# EasyEDA Pro project JP_Board.eprj, board PCB1
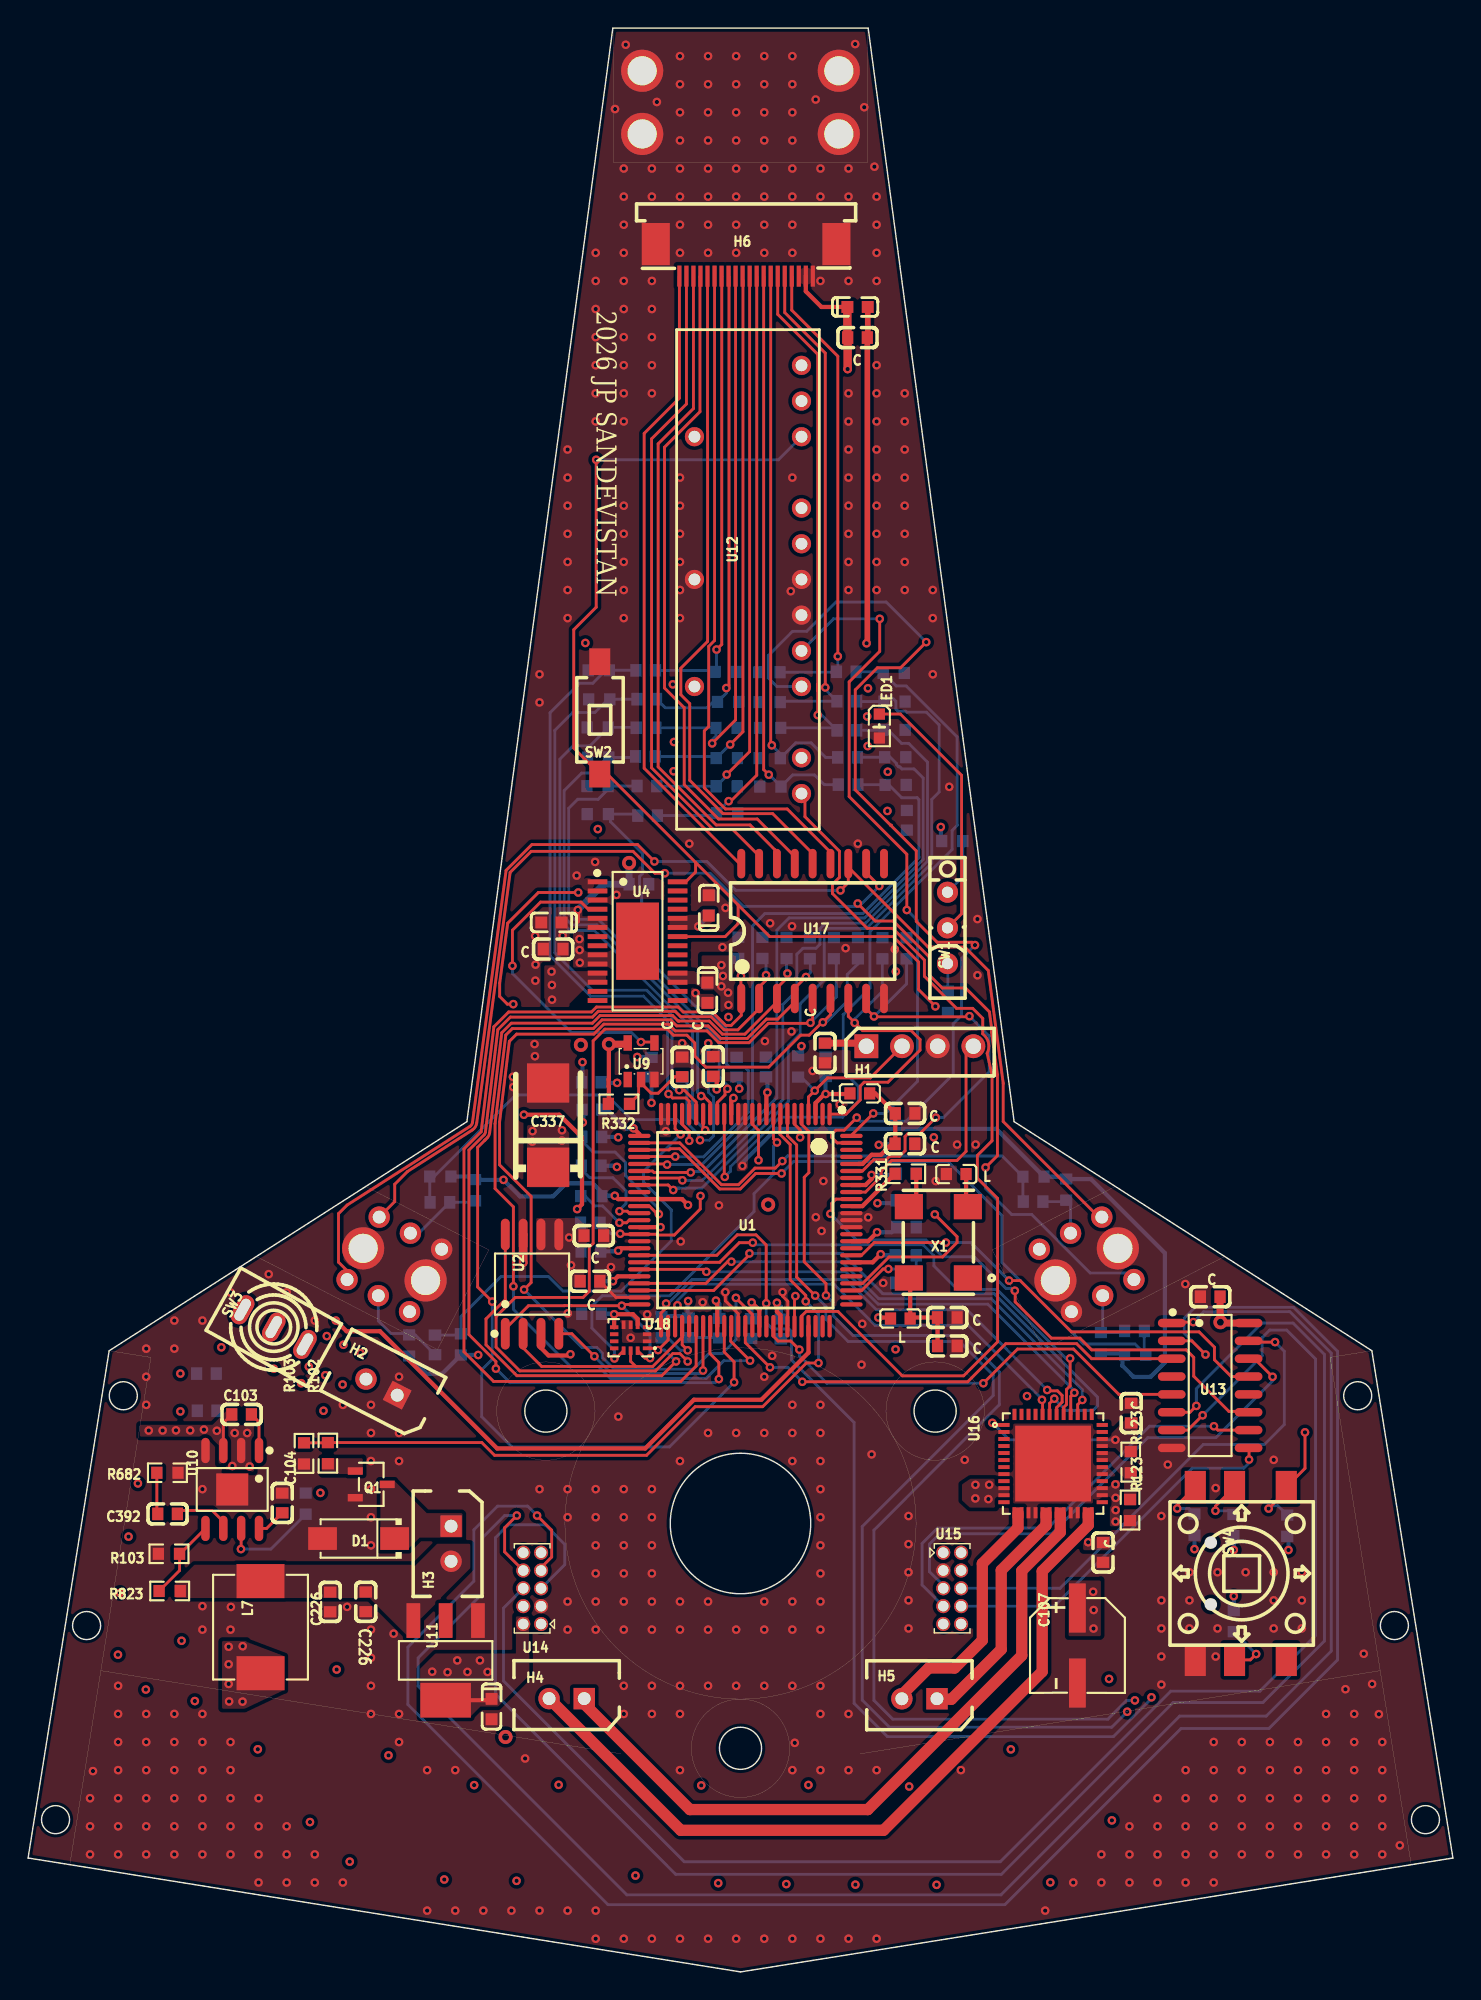
[diagram p3: board, top side]
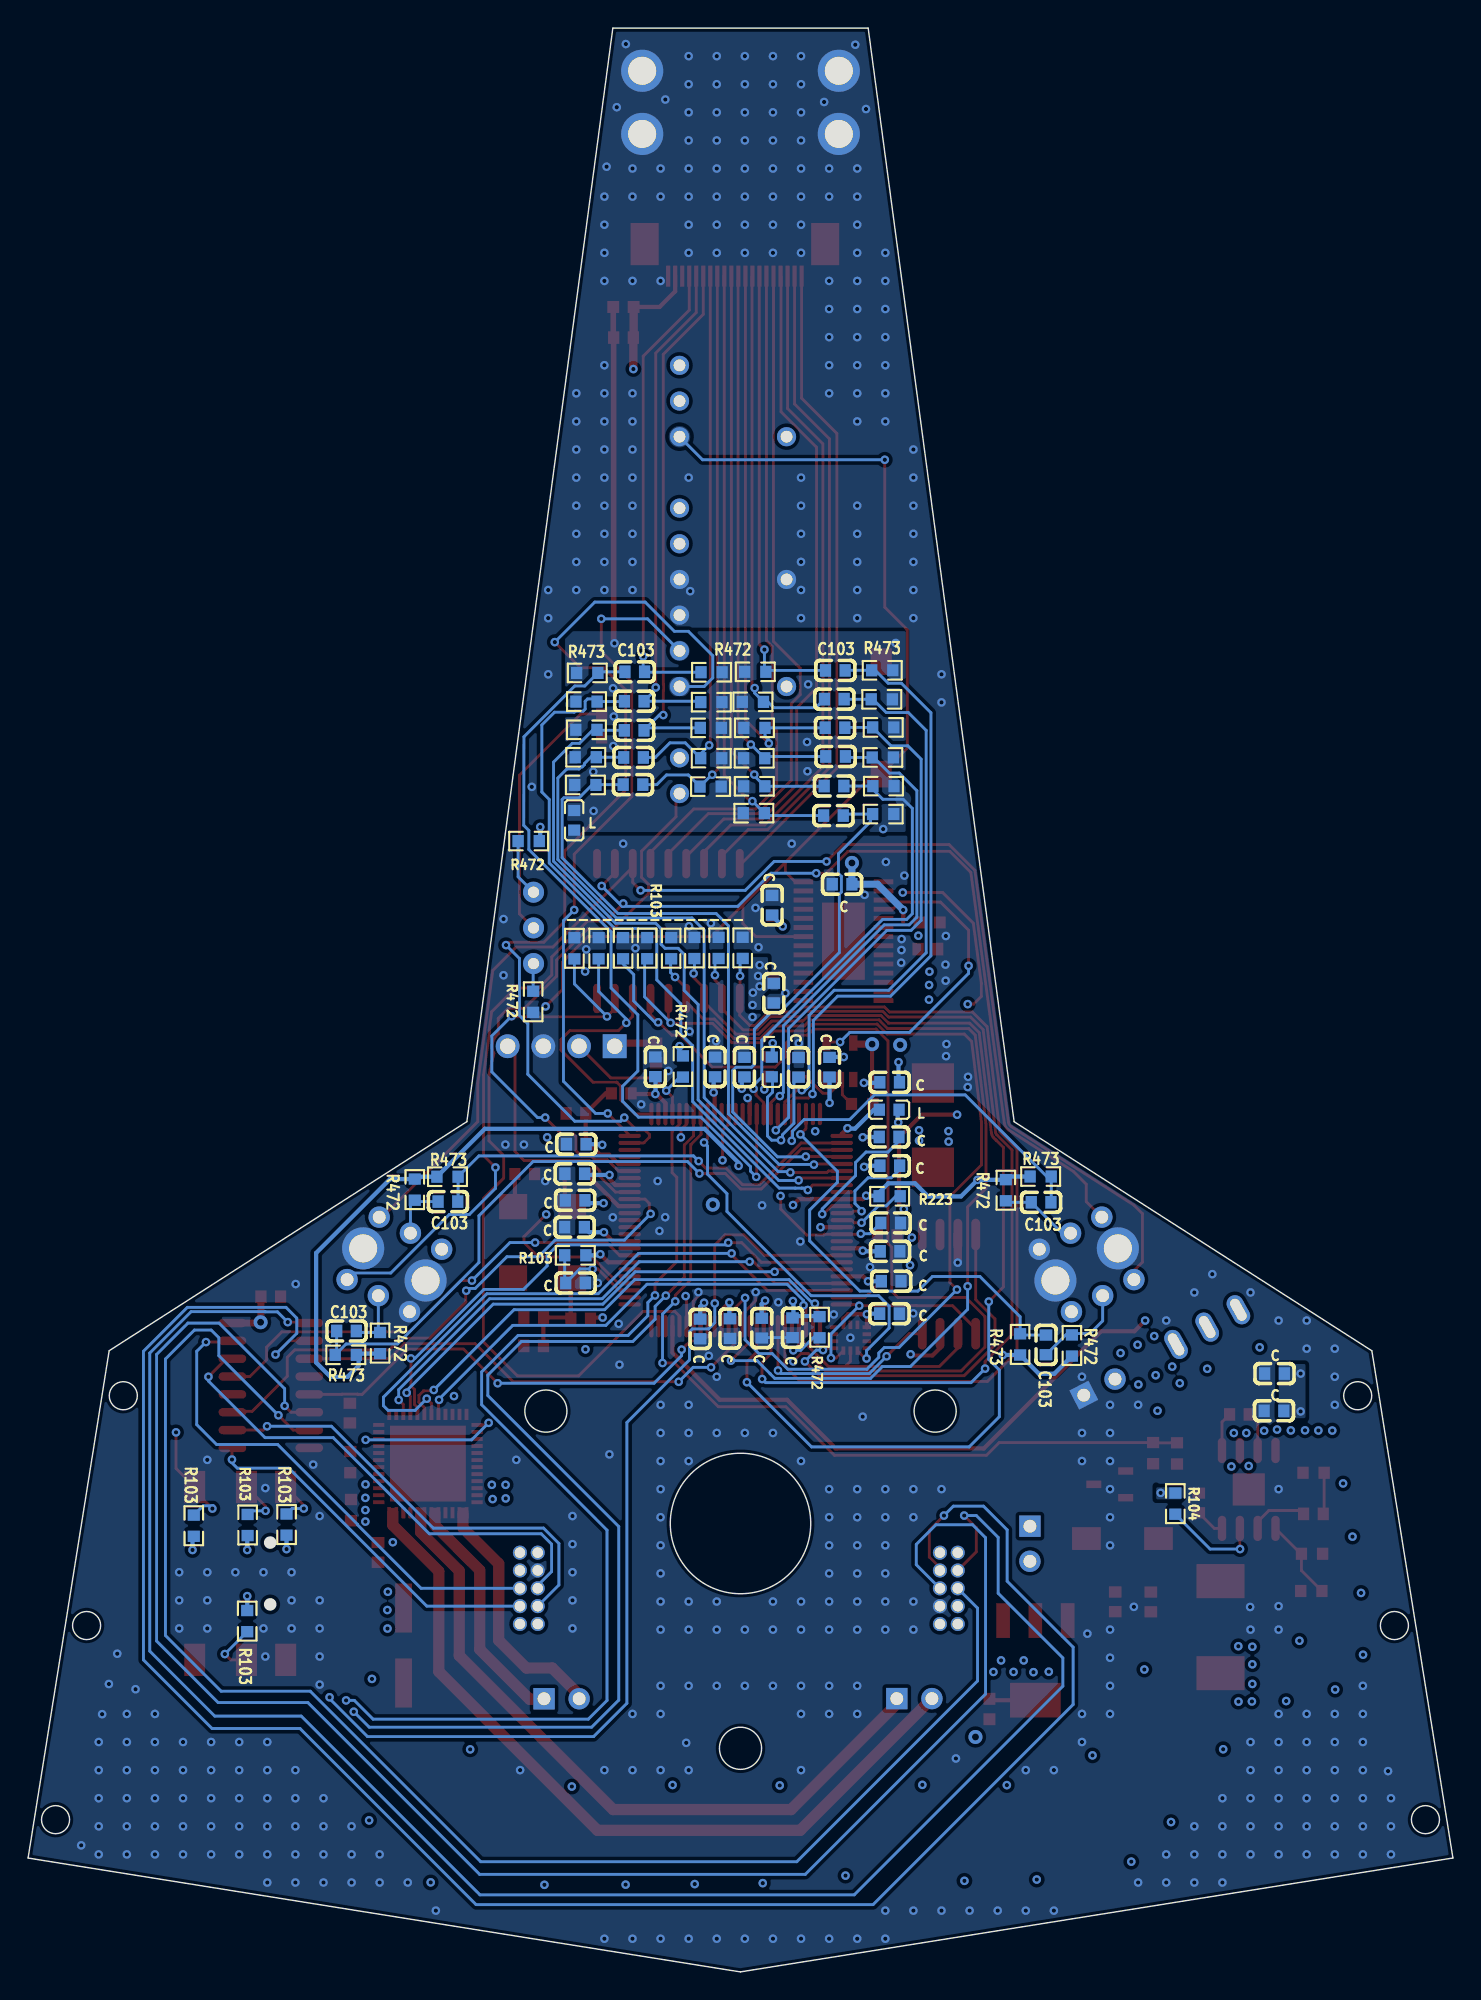
[diagram p4: board, bottom side, seen from below]

Outline 101.44 x 138.36 mm; copper layers: Top Layer, Inner1, Inner2, Bottom Layer. Coordinates in mm from the lower left corner of the outline.
Outline path: circle c1.95,10.84 r1 ; circle c4.16,24.65 r1 ; circle c6.78,41.01 r1 ; circle c36.86,39.92 r1.5 ; circle c50.72,31.92 r5 ; circle c50.72,15.92 r1.5 ; circle c64.58,39.92 r1.5 ; circle c94.66,41.01 r1 ; circle c97.28,24.65 r1 ; circle c99.48,10.84 r1 ; 0,8.11 5.77,44.21 31.24,60.52 41.63,138.36 59.81,138.36 70.2,60.52 95.67,44.21 101.44,8.11 50.72,0 0,8.11
Stack: Top Layer 0.035mm Outer layer thickness 1oz / Dielectric1 0.2104mm 7628 RC49% 8.6mil / Inner1 0.0152mm Inner layer thickness / Dielectric2 1.065mm 1.1mm H/HOZ Copper / Inner2 0.0152mm Inner layer thickness / Dielectric3 0.2104mm 7628 RC49% 8.6mil / Bottom Layer 0.035mm Outer layer thickness 1oz

## Design rules (mm)
template: Custom Config
spacing copperThickness1oz (default): track to track 0.102, other pairs 0.152 to 0.3
spacing copperThickness2oz: track to track 0.203, other pairs 0.152 to 0.3
spacing 5V: track to track 0.3, other pairs 0.152 to 0.3
track width copperThickness1oz (default): min 0.127, default 0.203, max 2.54
track width copperThickness2oz: min 0.203, default 0.254, max 2.54
track width 5V: min 0.127, default 0.3, max 2.54
track width 3.3V: min 0.127, default 0.3, max 2.54
differential pair differentialPair (default): width min 0.127, default 0.254, max 2.54; gap min 0.152, default 0.152
via viaSize (default): diameter min 0.5, default 0.61, max 10; hole min 0.3, default 0.305, max 6.3
net 5V uses 5V
net AGND uses 3.3V
net ADC_ANALOG_PWR uses 3.3V
net 3.3V uses 3.3V
net 1.8V uses 3.3V

## Placement (name value [footprint] x y rotation side)
C  -  [C0603]  40 49.16 0 top
C47  100nF  [C0603]  43.97 92.64 180 bottom
C48  100nF  [C0603]  44.04 90.59 180 bottom
C49  100nF  [C0603]  43.99 88.56 180 bottom
C50  100nF  [C0603]  43.95 86.51 180 bottom
C51  100nF  [C0603]  44.06 84.41 180 bottom
C52  100nF  [C0603]  44.1 82.31 180 bottom
C53  100nF  [C0603]  58.38 84.51 0 bottom
C54  100nF  [C0603]  58.34 86.45 0 bottom
C55  100nF  [C0603]  58.29 88.38 0 bottom
C56  100nF  [C0603]  58.28 90.45 0 bottom
C57  100nF  [C0603]  58.25 92.54 0 bottom
C58  100nF  [C0603]  28.97 44.63 90 bottom
C59  100nF  [C0603]  29.32 54.78 180 bottom
C60  100nF  [C0603]  71.55 54.83 180 bottom
C61  100nF  [C0603]  78.77 45.62 0 bottom
C103  100nF  [C0603]  15.2 39.68 0 top
C104  100nF  [C0603]  18.09 33.38 90 top
C107  100uF  [CAP-SMD_BD6.3-L6.6-W6.6-FD]  74.71 23.23 270 top
C226  -  [C0603]  24.04 26.34 270 top
C226#2  -  [C0603]  21.51 26.34 270 top
C337  330uF  [CASE-D_7343]  37.02 60.27 270 top
C392  100nF  [C0603]  9.93 32.6 0 top
C476  -  [CAP-SMD_L1.6-W0.8]  59.06 118.51 180 top
C476#2  -  [CAP-SMD_L1.6-W0.8]  48.46 75.91 270 top
C#2  -  [C0603]  76.53 29.86 90 top
C#3  -  [C0603]  78.53 39.77 90 top
C#4  -  [C0603]  65.44 46.58 0 top
C#5  -  [C0603]  48.78 64.45 90 top
C#6  -  [C0603]  65.45 44.56 0 top
C#7  -  [C0603]  56.74 65.41 90 top
C#8  -  [C0603]  62.43 58.95 0 top
C#9  -  [C0603]  62.44 61.11 0 top
C#10  -  [C0603]  59.05 116.33 0 top
C#11  -  [C0603]  84.16 48.06 180 top
C#12  -  [C0603]  46.56 64.42 270 top
C#13  -  [C0603]  40.27 52.41 0 top
C#14  -  [C0603]  37.38 72.81 180 top
C#15  -  [C0603]  40.09 57.38 180 bottom
C#16  -  [C0603]  40.14 59.43 0 bottom
C#17  -  [C0603]  62.41 58.91 0 bottom
C#18  -  [C0603]  51.47 45.79 270 bottom
C#19  -  [C0603]  53.59 45.77 270 bottom
C#20  -  [C0603]  62.53 53.01 0 bottom
C#21  -  [C0603]  40.07 51.29 180 bottom
C#22  -  [C0603]  12.74 39.94 0 bottom
C#23  -  [C0603]  12.7 42.59 0 bottom
C#24  -  [C0603]  40.11 46.85 0 bottom
C#25  -  [C0603]  52.53 64.41 90 bottom
C#26  -  [C0603]  62.52 56.81 0 bottom
C#27  -  [C0603]  49.2 45.82 270 bottom
C#28  -  [C0603]  62.49 54.92 180 bottom
C#29  -  [C0603]  50.44 64.4 270 bottom
C#30  -  [C0603]  40.03 53.31 180 bottom
C#31  -  [C0603]  46.59 64.39 90 bottom
C#32  -  [C0603]  56.78 64.42 90 bottom
C#33  -  [C0603]  44.38 64.39 90 bottom
C#34  -  [C0603]  40.1 63.32 180 bottom
C#35  -  [C0603]  43.49 77.42 0 bottom
C#36  -  [C0603]  48.47 75.92 90 bottom
C#37  -  [C0603]  48.35 69.67 270 bottom
C#38  -  [C0603]  62.46 49.04 180 bottom
C#39  -  [C0603]  47.02 45.85 270 bottom
C#40  -  [C0603]  39.99 49.16 180 bottom
D1  1N4007  [SMA_L4.4-W2.8-LS5.4-RD]  23.53 30.85 180 top
H1  -  [HDR-TH_4P-P2.54-V-F]  63.49 65.89 0 top
H2  Molex_5267_2P  [5267_2P]  26.28 41.05 152.8 top
H3  Molex_5267_2P  [5267_2P]  30.12 31.73 270 top
H4  RMOTOR  [5267_2P]  39.59 19.45 180 top
H5  LMOTOR  [5267_2P]  64.71 19.44 180 top
H6  AFC07-S20ECA-00  [FPC-SMD_AFC07-S20ECA-00]  51.12 121.84 180 top
L  -  [L0603]  62.1 46.51 0 top
L7  10uH  [IND-SMD_L7.3-W6.6]  16.55 24.54 270 top
L#2  -  [L0603]  66.08 56.79 0 top
L#3  -  [L0603]  59.22 62.53 0 top
L#4  -  [L0603]  48.49 64.41 270 bottom
L#5  -  [L0603]  40.13 61.37 180 bottom
L#6  -  [L0603]  62.56 81.97 90 bottom
LED1  -  [LED0603-R-RD]  60.6 88.68 270 top
NOREF  -  [Pad_e358]  73.14 49.22 0 top
NOREF#2  -  [Pad_e355]  72 51.44 180 top
NOREF#3  -  [Pad_e339]  29.44 51.44 0 top
NOREF#4  -  [Pad_e347]  25 53.72 0 top
NOREF#5  -  [Pad_e2882]  57.72 130.83 0 top
NOREF#6  -  [Pad_e2880]  43.72 135.32 0 top
NOREF#7  -  [Pad_e360]  77.59 51.5 0 top
NOREF#8  -  [Pad_e325]  28.3 49.22 0 top
NOREF#9  -  [Pad_e2881]  57.72 135.32 0 top
NOREF#10  -  [Pad_e335]  27.16 46.99 0 top
NOREF#11  -  [Pad_e2883]  43.72 130.83 0 top
NOREF#12  -  [Pad_e357]  74.28 46.99 180 top
NOREF#13  -  [Pad_e334]  24.94 48.13 0 top
NOREF#14  -  [Pad_e352]  78.73 49.28 180 top
NOREF#15  -  [Pad_e323]  23.85 51.5 0 top
NOREF#16  -  [Pad_e340]  27.22 52.58 0 top
NOREF#17  -  [Pad_e331]  22.71 49.28 0 top
NOREF#18  -  [Pad_e350]  76.44 53.72 180 top
NOREF#19  -  [Pad_e354]  74.22 52.58 180 top
NOREF#20  -  [Pad_e353]  76.5 48.13 180 top
Q1  AO3400A  [SOT-23-3_L3.0-W1.6-P1.90-LS2.8-BR]  24.43 34.7 180 top
R22  1k  [R0603]  50.56 72.89 270 bottom
R23  1k  [R0603]  52.28 72.89 270 bottom
R24  1k  [R0603]  54 72.88 270 bottom
R26  1k  [R0603]  57.37 72.87 270 bottom
R27  1k  [R0603]  59.08 72.87 270 bottom
R28  1k  [R0603]  60.82 72.86 270 bottom
R29  1k  [R0603]  62.54 72.86 270 bottom
R30  4.7KΩ  [R0603]  49.67 92.54 180 bottom
R31  47k  [R0603]  40.63 92.65 180 bottom
R32  4.7KΩ  [R0603]  49.84 90.4 180 bottom
R33  47k  [R0603]  40.66 90.58 180 bottom
R34  4.7KΩ  [R0603]  49.73 88.55 180 bottom
R35  47k  [R0603]  40.56 88.58 180 bottom
R36  4.7KΩ  [R0603]  49.75 86.39 180 bottom
R37  47k  [R0603]  40.59 86.44 180 bottom
R38  4.7KΩ  [R0603]  49.74 84.39 180 bottom
R39  47k  [R0603]  40.54 84.4 180 bottom
R40  4.7KΩ  [R0603]  49.77 82.48 180 bottom
R41  47k  [R0603]  40.56 82.41 180 bottom
R42  4.7KΩ  [R0603]  52.85 84.37 0 bottom
R43  47k  [R0603]  61.77 84.49 0 bottom
R44  4.7KΩ  [R0603]  52.8 86.39 0 bottom
R45  47k  [R0603]  61.74 86.46 0 bottom
R46  4.7KΩ  [R0603]  52.83 88.55 0 bottom
R47  47k  [R0603]  61.69 88.41 0 bottom
R48  4.7KΩ  [R0603]  52.8 90.38 0 bottom
R49  47k  [R0603]  61.68 90.42 0 bottom
R50  4.7KΩ  [R0603]  52.78 92.51 0 bottom
R51  47k  [R0603]  61.63 92.46 0 bottom
R52  4.7KΩ  [R0603]  27.12 44.59 90 bottom
R53  47k  [R0603]  30.81 44.67 270 bottom
R54  4.7KΩ  [R0603]  31.83 55.64 270 bottom
R55  47k  [R0603]  29.35 56.61 0 bottom
R56  4.7KΩ  [R0603]  73.91 55.68 270 bottom
R57  47k  [R0603]  71.58 56.6 0 bottom
R58  4.7KΩ  [R0603]  76.38 44.76 90 bottom
R59  47k  [R0603]  78.82 43.92 180 bottom
R102  1kΩ  [R0603]  21.34 36.92 90 top
R103  -  [R0603]  10.03 29.76 0 top
R103#2  -  [R0603]  19.64 36.91 270 top
R103#3  -  [R0603]  85.84 24.97 270 bottom
R103#4  -  [R0603]  83.04 31.84 90 bottom
R103#5  -  [R0603]  85.81 31.81 90 bottom
R103#6  -  [R0603]  89.64 31.76 90 bottom
R103#7  -  [R0603]  62.48 51.01 0 bottom
R103#8  -  [R0603]  55.66 72.87 270 bottom
R104  10kΩ  [R0603]  19.76 33.33 90 bottom
R123  -  [R0603]  78.5 36.28 270 top
R123#2  -  [R0603]  78.45 32.87 90 top
R223  22k  [R0603]  40.1 55.21 180 bottom
R331  330  [R0603]  62.48 56.81 180 top
R332  3.3k  [R0603]  42.06 61.79 180 top
R472  -  [R0603]  65.48 69.05 270 bottom
R472#2  -  [R0603]  65.8 80.49 180 bottom
R472#3  -  [R0603]  45.09 45.89 270 bottom
R472#4  -  [R0603]  54.82 64.45 270 bottom
R682  100kΩ  [R0603]  9.92 35.53 0 top
R823  10kΩ  [R0603]  10.08 27.11 0 top
SW1  BSI-10  [SW-TH_BSI-10]  65.46 74.31 90 top
SW2  TS-1101-C-W  [SW-SMD_L6.0-W3.3-LS8.0]  40.7 89.26 90 top
SW3  2MS3T4B1M1QES-5  [SW-TH_2MS3T4B1M1QES-5]  17.49 45.9 60.9 top
SW4  K1-1504SA-06  [SW-SMD_K1-1504SA-06]  86.34 28.36 90 top
U1  TMS320F2809PZA  [LQFP-100_L14.0-W14.0-P0.50-LS16.0-BL]  51.06 53.51 180 top
U2  AT45DB041E-SHN-T  [SOIC-8_L5.3-W5.3-P1.27-LS8.0-BL]  35.88 48.95 0 top
U4  TPS767D318PWPR  [TSSOP-28_L9.7-W4.4-P0.65-LS6.4-BL-EP5.5]  43.39 73.37 270 top
U5  47uF  [CAP-SMD_L1.6-W0.8]  37.26 74.7 0 top
U6  47uF  [CAP-SMD_L1.6-W0.8]  33 18.71 90 top
U8  47uF  [CAP-SMD_L1.6-W0.8]  48.37 69.7 90 top
U9  SN74LVC1G14DBVR  [SOT-23-5_L3.0-W1.7-P0.95-LS2.8-BR]  43.64 64.82 270 top
U10  MP2307DN-LF-Z  [SOP-8_L4.9-W3.9-P1.27-LS6.0-BL-EP]  14.53 34.34 180 top
U11  AMS1117-5.0  [SOT-223-4_L6.5-W3.5-P2.30-LS7.0-BR]  29.73 22.17 90 top
U12  -  [HCMS-2912]  47.44 109.27 270 top
U13  AM26LS32ACDR  [SOIC-16_L9.9-W3.9-P1.27-LS6.0-BL]  84.16 41.74 270 top
U14  L  [Encoder]  35.89 27.3 180 top
U15  R  [Encoder]  65.79 27.3 0 top
U16  TB67H420FTG,EL  [QFN-48_L7.0-W7.0-P0.50-BL-EP5.4]  72.98 36.18 270 top
U17  ULN2803G-S18-R  [SOIC-18_L11.6-W7.5-P1.27-LS10.3-BL]  55.85 74.09 0 top
U18  LSM6DSRTR  [LGA-14_L3.0-W2.5-P0.50-BR]  42.9 45.14 0 top
X1  S7050SMD25MOSC  [OSC-SMD_4P-L7.0-W5.0-BL-2]  64.81 51.93 90 top

## Footprints (pads in the part's own frame, mm; a bottom-side part is the same pattern mirrored in y, then rotated)
5267_2P
  rect 1.524x1.524 hole 0.914: 1(0,0)
  round 1.524 hole 0.914: 2(2.5,0)
C0603
  rect 0.8x0.9 smd: 1(-0.7,0) 2(0.7,0)
CAP-SMD_BD6.3-L6.6-W6.6-FD
  rect 3.5x1.2 smd: 1(-2.67,0) 2(2.67,0)
CAP-SMD_L1.6-W0.8
  rect 0.85x0.85 smd: 1(0.725,0) 2(-0.725,0)
CASE-D_7343
  rect 2.799x3.01 smd: 1(3,0) 2(-3,0)
Encoder
  round 1 hole 0.75x0.6: 1(-0.635,2.54) 2(0.635,2.54) 3(-0.635,1.27) 4(0.635,1.27) 5(-0.635,0) 6(0.635,0) 7(-0.635,-1.27) 8(0.635,-1.27) 9(-0.635,-2.54) 10(0.635,-2.54)
FPC-SMD_AFC07-S20ECA-00
  rect 0.3x1.5 smd: 1(-4.751,1.141) 2(-4.251,1.141) 3(-3.752,1.141) 4(-3.251,1.141) 5(-2.752,1.141) 6(-2.251,1.141) 7(-1.752,1.141) 8(-1.251,1.141) 9(-0.751,1.141) 10(-0.251,1.141) 11(0.248,1.141) 12(0.749,1.141) 13(1.248,1.141) 14(1.749,1.141) 15(2.245,1.14) 16(2.748,1.141) 17(3.248,1.141) 18(3.748,1.141) 19(4.248,1.141) 20(4.75,1.138)
  rect 2x3 smd: 21(-6.427,-1.141) 22(6.427,-1.141)
HCMS-2912
  round 1.365 hole 0.84: 3(0,0) 7(10.16,0) 10(17.78,0) 14(25.4,7.62) 15(22.86,7.62) 17(17.78,7.62) 18(15.24,7.62) 19(12.7,7.62) 20(10.16,7.62) 21(7.62,7.62) 22(5.08,7.62) 24(0,7.62) 25(-2.54,7.62) 26(-5.08,7.62)
HDR-TH_4P-P2.54-V-F
  rect 1.7x1.7 hole 1.1: 1(-3.81,0)
  round 1.7 hole 1.1: 2(-1.27,0) 3(1.27,0) 4(3.81,0)
IND-SMD_L7.3-W6.6
  rect 2.424x3.42 smd: 1(3.278,0) 2(-3.278,0)
L0603
  rect 0.8x0.864 smd: 1(-0.7,0) 2(0.7,0)
LED0603-R-RD
  rect 0.8x0.8 smd: 1(0.851,0) 2(-0.851,0)
LGA-14_L3.0-W2.5-P0.50-BR
  rect 0.6x0.27 smd: 1(1.17,-0.75) 2(1.17,-0.25) 3(1.17,0.25) 4(1.17,0.75) 8(-1.17,0.75) 9(-1.17,0.25) 10(-1.17,-0.25) 11(-1.17,-0.75)
  rect 0.27x0.6 smd: 5(0.5,0.92) 6(0,0.92) 7(-0.5,0.92) 12(-0.5,-0.92) 13(0,-0.92) 14(0.5,-0.92)
LQFP-100_L14.0-W14.0-P0.50-LS16.0-BL
  oval 0.3x1.6 smd: 1(-6,-7.55) 2(-5.5,-7.55) 3(-5,-7.55) 4(-4.5,-7.55) 5(-4,-7.55) 6(-3.5,-7.55) 7(-3,-7.55) 8(-2.5,-7.55) 9(-2,-7.55) 10(-1.5,-7.55) 11(-1,-7.55) 12(-0.5,-7.55) 13(0,-7.55) 14(0.5,-7.55) 15(1,-7.55) 16(1.5,-7.55) 17(2,-7.55) 18(2.5,-7.55) 19(3,-7.55) 20(3.5,-7.55) 21(4,-7.55) 22(4.5,-7.55) 23(5,-7.55) 24(5.5,-7.55) 25(6,-7.55) 51(6,7.55) 52(5.5,7.55) 53(5,7.55) 54(4.5,7.55) 55(4,7.55) 56(3.5,7.55) 57(3,7.55) 58(2.5,7.55) 59(2,7.55) 60(1.5,7.55) 61(1,7.55) 62(0.5,7.55) 63(0,7.55) 64(-0.5,7.55) 65(-1,7.55) 66(-1.5,7.55) 67(-2,7.55) 68(-2.5,7.55) 69(-3,7.55) 70(-3.5,7.55) 71(-4,7.55) 72(-4.5,7.55) 73(-5,7.55) 74(-5.5,7.55) 75(-6,7.55)
  oval 1.6x0.3 smd: 26(7.55,-6) 27(7.55,-5.5) 28(7.55,-5) 29(7.55,-4.5) 30(7.55,-4) 31(7.55,-3.5) 32(7.55,-3) 33(7.55,-2.5) 34(7.55,-2) 35(7.55,-1.5) 36(7.55,-1) 37(7.55,-0.5) 38(7.55,0) 39(7.55,0.5) 40(7.55,1) 41(7.55,1.5) 42(7.55,2) 43(7.55,2.5) 44(7.55,3) 45(7.55,3.5) 46(7.55,4) 47(7.55,4.5) 48(7.55,5) 49(7.55,5.5) 50(7.55,6) 76(-7.55,6) 77(-7.55,5.5) 78(-7.55,5) 79(-7.55,4.5) 80(-7.55,4) 81(-7.55,3.5) 82(-7.55,3) 83(-7.55,2.5) 84(-7.55,2) 85(-7.55,1.5) 86(-7.55,1) 87(-7.55,0.5) 88(-7.55,0) 89(-7.55,-0.5) 90(-7.55,-1) 91(-7.55,-1.5) 92(-7.55,-2) 93(-7.55,-2.5) 94(-7.55,-3) 95(-7.55,-3.5) 96(-7.55,-4) 97(-7.55,-4.5) 98(-7.55,-5) 99(-7.55,-5.5) 100(-7.55,-6)
OSC-SMD_4P-L7.0-W5.0-BL-2
  rect 1.8x2 smd: 1(-2.54,-2.1) 2(2.54,-2.1) 3(2.54,2.1) 4(-2.54,2.1)
Pad_e323
  round 3 hole 2: 1(0,0)
Pad_e325
  round 3 hole 2: 1(0,0)
Pad_e331
  round 1.524 hole 0.914: 1(0,0)
Pad_e334
  round 1.524 hole 0.914: 1(0,0)
Pad_e335
  round 1.524 hole 0.914: 2(0,0)
Pad_e339
  round 1.524 hole 0.914: 1(0,0)
Pad_e340
  round 1.524 hole 0.914: 2(0,0)
Pad_e347
  round 1.524 hole 0.914: 1(0,0)
Pad_e350
  round 1.524 hole 0.914: 1(0,0)
Pad_e352
  round 1.524 hole 0.914: 1(0,0)
Pad_e353
  round 1.524 hole 0.914: 1(0,0)
Pad_e354
  round 1.524 hole 0.914: 2(0,0)
Pad_e355
  round 1.524 hole 0.914: 1(0,0)
Pad_e357
  round 1.524 hole 0.914: 2(0,0)
Pad_e358
  round 3 hole 2: 1(0,0)
Pad_e360
  round 3 hole 2: 1(0,0)
Pad_e2880
  round 3 hole 2: 1(0,0)
Pad_e2881
  round 3 hole 2: 2(0,0)
Pad_e2882
  round 3 hole 2: 3(0,0)
Pad_e2883
  round 3 hole 2: 4(0,0)
QFN-48_L7.0-W7.0-P0.50-BL-EP5.4
  rect 0.28x0.8 smd: 1(-2.75,-3.5) 2(-2.25,-3.5) 3(-1.75,-3.5) 4(-1.25,-3.5) 5(-0.75,-3.5) 6(-0.25,-3.5) 7(0.25,-3.5) 8(0.75,-3.5) 9(1.25,-3.5) 10(1.75,-3.5) 11(2.25,-3.5) 12(2.75,-3.5) 25(2.75,3.5) 26(2.25,3.5) 27(1.75,3.5) 28(1.25,3.5) 29(0.75,3.5) 30(0.25,3.5) 31(-0.25,3.5) 32(-0.75,3.5) 33(-1.25,3.5) 34(-1.75,3.5) 35(-2.25,3.5) 36(-2.75,3.5)
  rect 0.8x0.28 smd: 13(3.5,-2.75) 14(3.5,-2.25) 15(3.5,-1.75) 16(3.5,-1.25) 17(3.5,-0.75) 18(3.5,-0.25) 19(3.5,0.25) 20(3.5,0.75) 21(3.5,1.25) 22(3.5,1.75) 23(3.5,2.25) 24(3.5,2.75) 37(-3.5,2.75) 38(-3.5,2.25) 39(-3.5,1.75) 40(-3.5,1.25) 41(-3.5,0.75) 42(-3.5,0.25) 43(-3.5,-0.25) 44(-3.5,-0.75) 45(-3.5,-1.25) 46(-3.5,-1.75) 47(-3.5,-2.25) 48(-3.5,-2.75)
  rect 5.4x5.4 smd: 49(0,0)
R0603
  rect 0.806x0.864 smd: 1(-0.753,0) 2(0.753,0)
SMA_L4.4-W2.8-LS5.4-RD
  rect 2.046x1.62 smd: 1(-2.566,0) 2(2.566,0)
SOIC-8_L5.3-W5.3-P1.27-LS8.0-BL
  oval 0.63x2.25 smd: 1(-1.905,-3.53) 2(-0.635,-3.53) 3(0.635,-3.53) 4(1.905,-3.53) 5(1.905,3.53) 6(0.635,3.53) 7(-0.635,3.53) 8(-1.905,3.53)
SOIC-16_L9.9-W3.9-P1.27-LS6.0-BL
  oval 0.602x1.971 smd: 1(-4.445,-2.736) 2(-3.175,-2.736) 3(-1.905,-2.736) 4(-0.635,-2.736) 5(0.635,-2.736) 6(1.905,-2.736) 7(3.175,-2.736) 8(4.445,-2.736) 9(4.445,2.736) 10(3.175,2.736) 11(1.905,2.736) 12(0.635,2.736) 13(-0.635,2.736) 14(-1.905,2.736) 15(-3.175,2.736) 16(-4.445,2.736)
SOIC-18_L11.6-W7.5-P1.27-LS10.3-BL
  oval 0.56x2.1 smd: 1(-5.08,-4.8) 2(-3.81,-4.8) 3(-2.54,-4.8) 4(-1.27,-4.8) 5(0,-4.8) 6(1.27,-4.8) 7(2.54,-4.8) 8(3.81,-4.8) 9(5.08,-4.8) 10(5.08,4.8) 11(3.81,4.8) 12(2.54,4.8) 13(1.27,4.8) 14(0,4.8) 15(-1.27,4.8) 16(-2.54,4.8) 17(-3.81,4.8) 18(-5.08,4.8)
SOP-8_L4.9-W3.9-P1.27-LS6.0-BL-EP
  oval 0.6x1.8 smd: 1(-1.905,-2.772) 2(-0.635,-2.772) 3(0.635,-2.772) 4(1.905,-2.772) 5(1.905,2.772) 6(0.635,2.772) 7(-0.635,2.772) 8(-1.905,2.772)
  rect 2.29x2.29 smd: 9(0,0)
SOT-23-3_L3.0-W1.6-P1.90-LS2.8-BR
  rect 1.07x0.532 smd: 1(1.135,-0.95) 2(1.135,0.95) 3(-1.135,0)
SOT-23-5_L3.0-W1.7-P0.95-LS2.8-BR
  rect 1.1x0.6 smd: 1(1.3,-0.95) 2(1.3,0) 3(1.3,0.95) 4(-1.3,0.95) 5(-1.3,-0.95)
SOT-223-4_L6.5-W3.5-P2.30-LS7.0-BR
  rect 2.47x0.98 smd: 1(2.835,-2.3) 2(2.835,0) 3(2.835,2.3)
  rect 2.47x3.6 smd: 4(-2.835,0)
SW-SMD_K1-1504SA-06
  rect 2.3x1.5 smd: 1(-6.15,3.239) 2(-6.15,0.445) 3(-6.15,-3.239) 4(6.15,3.239) 5(6.15,0.445) 6(6.15,-3.239)
SW-SMD_L6.0-W3.3-LS8.0
  rect 1.9x1.5 smd: 1(-4,0) 2(4,0)
SW-TH_2MS3T4B1M1QES-5
  oval 2.2x1.2 hole 1.7x0.7: 1(0,-2.54) 2(0,0) 3(0,2.54)
SW-TH_BSI-10
  round 1.5 hole 0.8: 1(0,0) 2(-2.54,0) 3(2.54,0)
TSSOP-28_L9.7-W4.4-P0.65-LS6.4-BL-EP5.5
  rect 0.35x1.4 smd: 1(-4.225,-2.85) 2(-3.575,-2.85) 3(-2.925,-2.85) 4(-2.275,-2.85) 5(-1.625,-2.85) 6(-0.975,-2.85) 7(-0.325,-2.85) 8(0.325,-2.85) 9(0.975,-2.85) 10(1.625,-2.85) 11(2.275,-2.85) 12(2.925,-2.85) 13(3.575,-2.85) 14(4.225,-2.85) 15(4.225,2.85) 16(3.575,2.85) 17(2.925,2.85) 18(2.275,2.85) 19(1.625,2.85) 20(0.975,2.85) 21(0.325,2.85) 22(-0.325,2.85) 23(-0.975,2.85) 24(-1.625,2.85) 25(-2.275,2.85) 26(-2.925,2.85) 27(-3.575,2.85) 28(-4.225,2.85)
  rect 5.5x3.05 smd: 29(0,0)

## Nets
1.8V: C476#2.1 C#19.1 C#20.1 C#21.1 C#25.1 C#26.1 C#27.1 C#28.2 C#29.2 C#36.1 L#4.1 U1.10 U1.42 U1.59 U1.68 U1.85 U1.93 U4.23 U4.24
3.3V: C.1 C#5.1 C#13.1 C#17.1 C#18.1 C#24.2 C#32.1 C#37.1 C#39.1 C#40.1 L.1 L#3.1 L#5.2 R103#3.1 R103#4.1 R103#5.1 R103#6.1 R103#7.1 R472#2.2 R472#3.1 R472#4.1 U1.3 U1.46 U1.65 U1.82 U2.3 U2.5 U2.6 U4.17 U4.18 U8.1 U18.5 U18.8
5V: C337.1 C#7.2 C#11.1 C#14.1 C#35.1 H1.1 R332.2 U4.5 U4.6 U4.11 U4.12 U5.1 U6.1 U9.5 U11.4 U12.3 U12.10 U12.21 U12.22 U13.16 U14.2 U15.2
8.4V: C226.1 C226#2.1 H3.2 L7.2 R823.2 U11.3
16.8V: C107.1 C#2.2 C#22.1 C#23.1 R104.2 SW3.2 U10.2 U16.10 U16.11 U16.26 U16.27
AGND: C476.2 C#10.2 C#15.1 C#16.2 C#33.2 C#34.2 L#6.2 R30.1 R31.2 R32.1 R33.2 R34.1 R35.2 R36.1 R37.2 R38.1 R39.2 R40.1 R41.2 R42.1 R43.2 R44.1 R45.2 R46.1 R47.2 R48.1 R49.2 R50.1 R51.2 R52.1 R53.2 R54.1 R55.2 R56.1 R57.2 R58.1 R59.2 R223.1 U1.13 U1.14 U1.24 U1.25 U1.35 U1.39
GND: C.2 C104.2 C107.2 C226.2 C226#2.2 C337.2 C476#2.2 C#2.1 C#3.2 C#4.2 C#5.2 C#6.2 C#7.1 C#8.2 C#9.2 C#11.2 C#12.1 C#13.2 C#14.2 C#17.2 C#18.2 C#19.2 C#20.2 C#21.2 C#22.2 C#23.2 C#24.1 C#25.2 C#26.2 C#27.2 C#28.1 C#29.1 C#30.2 C#31.2 C#32.2 C#35.2 C#36.2 C#37.2 C#38.2 C#39.2 C#40.2 D1.2 H1.3 H2.1 H6.1 H6.21 H6.22 L#2.1 L#6.1 LED1.1 NOREF.1 NOREF#3.1 NOREF#5.3 NOREF#6.1 NOREF#7.1 NOREF#8.1 NOREF#9.2 NOREF#11.4 NOREF#12.2 NOREF#15.1 Q1.2 R22.1 R23.1 R24.1 R26.1 R27.1 R28.1 R29.1 R103.1 R103#2.2 R103#8.1 R123#2.1 R472.2 R682.2 SW2.2 SW4.1 U1.2 U1.11 U1.41 U1.49 U1.55 U1.62 U1.69 U1.77 U1.87 U1.88 U1.89 U1.94 U2.7 U4.3 U4.9 U4.10 U5.2 U6.2 U8.2 U9.3 U10.4 U10.9 U11.1 U12.7 U12.19 U12.20 U13.8 U14.3 U15.3 U16.2 U16.8 U16.15 U16.16 U16.21 U16.22 U16.29 U16.30 U16.35 U16.49 U17.9 U18.2 U18.3 U18.6 U18.7
1A: U13.2 U14.7
1B: U13.1 U14.8
2A: U13.6 U14.5
2B: U13.7 U14.6
3A: U13.10 U15.7
3B: U13.9 U15.8
4A: U13.14 U15.5
4B: U13.15 U15.6
ADC_ANALOG_PWR: C476.1 C#10.1 C#33.1 C#34.1 H6.2 L#5.1 NOREF#2.1 NOREF#10.2 U1.15 U1.26
ADC_DIG_PWR: C#30.1 C#31.1 L#4.2 U1.12 U1.40
CLK: R331.2 U1.90
D1: R22.2 U1.56 U17.1
D2: R23.2 U1.58 U17.2
D3: R24.2 U1.60 U17.3
D4: R103#8.2 U1.61 U17.4
D5: R26.2 U1.64 U17.5
D6: R27.2 U1.70 U17.6
DD1: H6.20 U17.18
DD2: H6.19 U17.17
DD3: H6.18 U17.16
DD4: H6.17 U17.15
DD5: H6.16 U17.14
DD6: H6.15 U17.13
EPWMA: U1.47 U16.39
EPWMB: U1.45 U16.40
EQEP1A: U1.63 U13.3
EQEP1B: U1.67 U13.5
EQEP2A: U1.83 U13.13
EQEP2B: U1.91 U13.11
FAN: R102.2 R103#2.1 U1.8
FLASH_PWR: C#8.1 C#9.1 L#3.2 U1.96
LED1: LED1.2 SW1.1 U1.79
LQ1: C58.2 R53.1 U1.23
LQ2: C59.2 R55.1 U1.22
LQQ1: C58.1 NOREF#13.1 R52.2
LQQ2: C59.1 NOREF#16.2 R54.2
MOTOR_AIN1: U1.44 U16.41
MOTOR_AIN2: U1.51 U16.42
MOTOR_BIN1: U1.48 U16.43
MOTOR_BIN2: U1.53 U16.44
Q1: C47.2 R31.1 U1.21
Q2: C48.2 R33.1 U1.20
Q3: C49.2 R35.1 U1.19
Q4: C50.2 R37.1 U1.18
Q5: C51.2 R39.1 U1.17
Q6: C52.2 R41.1 U1.29
Q7: C53.2 R43.1 U1.30
Q8: C54.2 R45.1 U1.31
Q9: C55.2 R47.1 U1.32
Q10: C56.2 R49.1 U1.33
Q11: C57.2 R51.1 U1.16
QQ1: C47.1 H6.14 R30.2
QQ2: C48.1 H6.13 R32.2
QQ3: C49.1 H6.12 R34.2
QQ4: C50.1 H6.11 R36.2
QQ5: C51.1 H6.10 R38.2
QQ6: C52.1 H6.9 R40.2
QQ7: C53.1 H6.8 R42.2
QQ8: C54.1 H6.7 R44.2
QQ9: C55.1 H6.6 R46.2
QQ10: C56.1 H6.5 R48.2
QQ11: C57.1 H6.4 R50.2
RESET: C#38.1 R103#7.2 SW2.1 U1.78 U4.22 U4.28 U12.24
RQ1: C60.2 R57.1 U1.27
RQ2: C61.2 R59.1 U1.28
RQQ1: C60.1 NOREF#19.2 R56.2
RQQ2: C61.1 NOREF#20.1 R58.2
SCIRXD: H1.4 U1.92
SCITXD: H1.2 R472#4.2 U1.4
SPI_CLK: R472#3.2 U1.54 U2.2 U18.13
SPI_MISO: U1.52 U2.8 U18.1
SPI_MOSI: U1.50 U2.1 U18.14
SPIGYRO_CS: U1.9 U18.12
SPIROM_CS: U1.57 U2.4
SW_D: R103#4.2 SW4.4 U1.7
SW_L: R103#5.2 SW4.5 U1.5
SW_R: R103#3.2 SW4.2 U1.43
SW_U: R103#6.2 SW4.6 U1.6
VFD_CE: U1.100 U12.18
VFD_CLK: U1.99 U12.17
VFD_DATA: U1.71 U12.14
VFD_RS: U1.72 U12.15
W0: R28.2 U1.1 U17.7
W1: R29.2 U1.95 U17.8
WW0: NOREF#17.1 NOREF#18.1 U17.12
WW1: NOREF#4.1 NOREF#14.1 U17.11
$1N1621: R223.2 U1.38
$1N1634: C#15.2 U1.37
$1N1700: C#16.1 U1.36
$1N3268: L#2.2 X1.2
$1N3946: R472.1 SW1.2
$1N3972: R472#2.1 SW1.3
$1N7683: C#12.2 R332.1 U9.2
$1N7775: U4.4 U9.4
$1N30387: C#4.1 C#6.1 L.2 X1.4
$1N31964: R331.1 X1.3
$2N865: C103.1 L7.1 U10.3
$2N866: C103.2 U10.1
$2N870: R104.1 U10.7
$2N871: R103.2 R823.1 U10.5
$2N872: C104.1 U10.8
$2N873: C392.2 U10.6
$2N874: C392.1 R682.1
$2N878: H2.2 SW3.1
$2N881: Q1.1 R102.1
$2N883: D1.1 H3.1 Q1.3
$2N1919: C#3.1 R123.1 U16.1 U16.33 U16.34
$2N1931: R123.2 R123#2.2 U16.31 U16.32
$2N1936: H5.2 U16.13 U16.14
$2N1937: H5.1 U16.17 U16.18
$2N1938: H4.1 U16.19 U16.20
$2N1939: H4.2 U16.23 U16.24

Pads without a net: H6 3; SW3 3; SW4 3; U1 34 66 73 74 75 76 80 81 84 86 97 98; U4 1 2 7 8 13 14 15 16 19 20 21 25 26 27 29; U9 1; U11 2; U12 25 26; U13 4 12; U14 1 4 9 10; U15 1 4 9 10; U16 3 4 5 6 7 9 12 25 28 36 37 38 45 46 47 48; U17 10; U18 4 9 10 11; X1 1

## Via types
v1: diameter 0.61, hole 0.305, Top Layer to Bottom Layer, 721 vias
v2: diameter 1, hole 0.5, Top Layer to Bottom Layer, 6 vias

## Routing (per net, layer and track width the routed paths; a pad name or vN(x,y) marks a point on that pad's centre or on a via; arc(x,y) is an arc through that point)
1.8V: length 86.4
  Top Layer w0.3: v1(60.05,56.72) 60.05,56.44 59.62,56.01 U1.93 ; v1(60.44,52.65) 59.8,52.01 U1.85 ; 53.56,45.96 53.56,46.75 53.31,47 v1(53.31,47.63) ; U1.10 52.56,62.53 v1(52.63,62.6) ; U1.42 42.19,51.51 v1(42.01,51.34) ; U1.59 49.06,47.69 v1(48.97,47.78)
  Inner1 w0.3: v1(60.47,54.72) 60.49,54.72 60.5,54.72
  Inner1 w0.4: v1(48.42,66.1) 48.66,66.34 48.66,73.47 v1(47.72,74.42)
  Inner2 w0.4: v1(48.42,66.1) 50.63,63.9 v1(50.63,62.87) 52.36,62.87 v1(52.63,62.6) 52.66,62.57 52.66,54.69 52.62,54.65 ; 52.62,54.65 48.97,50.93 v1(48.97,47.78) ; 52.62,54.65 52.51,54.54 50.16,54.54 46.96,51.34 v1(42.01,51.34) ; v1(60.47,54.72) 60.47,52.68 v1(60.44,52.65) ; v1(60.47,54.72) 60.47,56.3 v1(60.05,56.72) ; v1(60.47,54.72) 60.37,54.62 v2(52.69,54.62) 52.69,48.48 53.31,47.86 v1(53.31,47.63)
  Bottom Layer w0.3: 49.21,46.48 49.21,47.54 v1(48.97,47.78) ; C#20.1 61.48,52.65 v1(60.44,52.65) ; C#21.1 41.97,51.29 v1(42.01,51.34) ; C#28.2 61.59,54.72 v1(60.47,54.72) ; C#36.1 48.47,75.17 v1(47.72,74.42) ; 52.53,63.67 52.63,63.57 v1(52.63,62.6) ; 48.49,65.11 48.42,65.18 v1(48.42,66.1) ; v1(60.05,56.72) 61.74,56.72 C#26.1 ; v1(50.63,62.87) 50.63,63.47 50.44,63.66 ; v1(53.31,47.63) 53.59,47.35 53.59,46.42
3.3V: length 99.2
  Top Layer w0.3: L.1 61.33,46.58 v1(60.54,46.58) ; v1(51.51,47.65) 52.06,47.1 U1.65 ; v1(38.61,43.96) 38.52,43.88 37.05,43.88 36.51,44.42 U2.3 ; L#3.1 58.47,62.49 v1(56.78,62.49) 56.7,62.49 56.06,61.85 U1.3 ; v1(60.7,51.08) 60.12,50.51 U1.82 ; 37.8,52.47 U2.5 ; U1.46 41.99,49.51 v1(41.64,49.16) ; C#5.1 49.03,63.5 v1(49.03,62.81) ; U18.8 41.72,45.89 v1(41.72,46.81) 41.73,46.81 43.07,46.81 43.4,46.48 U18.5
  Inner2 w0.3: 40.08,64.98 40.08,61.05 v1(39.49,60.47)
  Inner2 w0.5: v1(61.78,71.21) 61.58,71.21 60.01,72.79 60.01,74.95 61.31,76.25 61.31,77.82 v1(64.98,81.49) ; v1(60.7,51.08) 66.58,51.08 72.18,45.48 77.61,45.48 79.98,47.85 84.63,47.85 89.73,42.74 v1(89.73,30.03)
  Bottom Layer w0.3: R103#7.1 60.78,51.01 v1(60.7,51.08) ; R103#6.1 89.73,30.92 v1(89.73,30.03) ; 51.49,46.44 51.51,46.46 v1(51.51,47.65) ; 40.69,49.16 40.69,49.16 v1(41.64,49.16) ; v1(85.84,30.03) 85.84,31.03 85.81,31.06 ; C#17.1 60.61,58.91 v1(60.57,58.87) ; 64.98,80.74 v1(64.98,81.49) ; v1(41.72,46.81) 41.69,46.85 C#24.2 ; v1(85.84,26.75) 85.84,25.72 ; 54.83,65.12 55.06,65.34 v1(55.06,65.89) ; v1(56.78,62.49) 56.77,62.5 56.77,63.63 ; v1(46.99,47.75) 46.95,47.71 46.95,46.55 46.82,46.68 45.5,46.68 ; 39.53,61.37 39.53,60.51 v1(39.49,60.47) ; R103#4.1 v1(83.04,30.09)
  vias: v1(38.52,52.27) v1(38.65,50.3) v1(49.36,71.66) v1(49.36,70.15) v1(49.47,70.89) v1(49.84,69.7) v1(49.86,68.82) v1(61.76,44.31)
5V: length 188.2
  Top Layer w0.3: v2(41.35,66.04) 41.35,63.56 41.33,63.53 41.33,63.03 41.35,63.01 41.35,61.83 R332.2 ; v1(39.14,75.59) 39.14,74.76 ; U11.4 32.9,19.34 U6.1
  Top Layer w0.5: v2(41.35,66.04) 42.61,66.04 U9.5 ; 86.89,46.19 84.94,46.19 v2(84.89,46.24) 84.86,46.27 C#11.1 ; H1.1 59.46,66.11 C#7.2
  Inner2 w0.8: U12.3 49.98,109.27 U12.22 U12.21 47.44,94.03 U12.10 ; v2(84.89,46.24) 81.44,42.8 63.04,42.8 61.22,40.98 61.22,35.44 66.43,30.24 U15.2 66.83,29.84 68.65,28.03 68.65,23.69 67.14,22.18 36.88,22.18 35.25,23.81 35.25,24.76 ; U12.10 49.44,89.49 54.23,89.49 59.89,83.83 64.65,83.83 65.93,82.56 65.93,80.41 63.42,77.9 63.42,69.99 59.68,66.25 H1.1 ; U12.10 47.44,83.59 v2(42.79,78.94) ; v2(39.36,65.98) 41.3,65.98 v2(41.35,66.04)
  Bottom Layer w0.5: v1(39.14,75.59) 40.97,77.42 C#35.1 42.79,77.42 v2(42.79,78.94)
  vias: v1(28.77,21.37) v1(29.86,21.33) v1(30.56,22.17) v1(31.28,21.35) v1(32.17,22.17) v1(32.71,21.35) v1(35.91,59.84) v1(35.9,59.1) v1(37.27,71.2) v1(37.29,70.25) v1(37.3,69.2) v1(38.06,73.75) v1(38.01,59.91) v1(38.01,59.17)
16.8V:
  vias: v1(10.84,42.59) v1(10.84,39.89) v1(13.76,44.46) v1(14.54,36.01) v1(14.71,38.36) v1(15.6,38.36) v1(15.77,35.97) v1(16.36,15.85) v1(17.49,42.93) v1(19.45,41.9) v1(20.07,10.67) v1(20.81,34.1) v1(21.03,39.94) v1(21.97,21.52) v1(22.9,7.85) v1(25.66,15.41) v1(29.63,6.57) v1(31.76,13.29) v1(34.78,6.48) v1(37.77,13.31) v1(43.24,6.85) v1(47.93,13.27) v1(49.13,6.32) v1(53.98,6.25) v1(55.56,13.31) v1(58.9,6.21) v1(62.73,13.19) v1(64.68,6.2) v1(67.44,34.67) v1(67.44,33.7) v1(68.37,33.66) v1(68.43,34.67) v1(69.97,15.84) v1(72.78,6.37) v1(75.47,30.58) v1(75.83,27.06) v1(75.86,25.76) v1(75.85,24.44) v1(76.96,20.86) v1(77.16,10.79) v1(77.42,34.7) v1(77.43,33.74) v1(77.43,32.87) v1(77.43,32.05)
AGND: length 117.4
  Top Layer w0.305: v1(46.98,54.58) 46.56,55.01 U1.35 42.01,55.01 v1(41.77,55.25) ; U1.39 v1(45.03,53.01)
  Top Layer w0.4: v1(59.7,94.57) 59.75,94.62 C#10.2 59.78,116.36 C476.2
  Inner1 w0.4: v1(32.05,43.91) 32.05,54.58 v1(33.84,56.38)
  Bottom Layer w0.3: R52.1 28.39,42.57 29.47,42.57 R53.2 v1(32.05,43.91) ; 44.38,65.04 44.3,65.12 v1(43.37,65.12) ; v1(42.02,59.41) 41.99,59.43 C#16.2 ; 77.98,44.01 77.91,43.93 77.91,43.15 78.7,42.35 79.91,42.35 80.94,43.38 80.94,51.17 75.67,56.43 R56.1 73.74,56.6 R57.2 68.92,60.01 53.27,60.01 50.86,57.59 v1(50.86,57.37) ; 77.98,44.01 R59.2 ; 77.98,44.01 R58.1 ; v1(41.92,57.3) 41.84,57.38 C#15.1 ; v1(41.77,55.25) 40.89,55.25 R223.1 40.85,55.48 40.2,56.13 38.3,56.13 37.37,55.2 35.02,55.2 v1(33.84,56.38) 31.85,56.38 R54.1 31.61,56.61 R55.2 ; 39.51,63.32 39.47,63.36 v1(39.47,64.76)
  vias: v1(39.68,94.59) v1(40.56,81.34) v1(45.4,59.84) v1(45.9,91.65) v1(45.96,85.46) v1(45.98,87.54) v1(59.74,89.36) v1(59.79,91.37) v1(59.78,87.25) v1(61.21,85.43) v1(61.18,82.64)
GND: length 13.4
  Top Layer w0.203: v1(53.72,48.39) 53.72,48.1 54.08,47.73 54.08,45.98 54.06,45.96 ; U1.62 50.56,46.85 49.64,47.77 v1(49.64,48.39) ; C.2 41.85,48.01 U1.49
  Top Layer w0.6: U2.7 35.25,52.47 v1(35.25,50.49)
  Inner1 w0.6: v1(47.52,69.67) 47.53,69.68 47.98,69.68
  Bottom Layer w0.203: 46.95,45.15 49.14,45.15 49.21,45.08
  vias: v1(4.41,12.36) v1(4.41,10.36) v1(4.41,8.36) v1(4.62,14.29) v1(6.41,20.36) v1(6.41,18.36) v1(6.41,16.36) v1(6.41,14.36) v1(6.41,12.36) v1(6.41,10.36) v1(6.41,8.36) v1(8.41,44.36) v1(8.41,42.36) v1(8.41,40.36) v1(8.41,18.36) v1(8.41,16.36) v1(8.41,14.36) v1(8.41,12.36) v1(8.41,10.36) v1(8.41,8.36) v1(10.41,46.36) v1(10.41,44.36) v1(10.41,18.36) v1(10.41,16.36) v1(10.41,14.36) v1(10.41,12.36) v1(10.41,10.36) v1(10.41,8.36) v1(12.41,46.36) v1(12.41,34.36) v1(12.41,26.03) v1(12.41,24.36) v1(12.41,18.36) v1(12.41,16.36) v1(12.41,14.36) v1(12.41,12.36) v1(12.41,10.36) v1(12.41,8.36) v1(14.41,48.36) v1(14.44,25.98) v1(14.41,24.36) v1(14.41,16.36) v1(14.41,14.36) v1(14.41,12.36) v1(14.41,10.36) v1(14.41,8.36) v1(16.41,12.36) v1(16.41,10.36) v1(16.41,8.36) v1(16.41,6.36) v1(17.13,49.66) v1(18.41,48.36) v1(18.41,10.36) v1(18.41,8.36) v1(18.41,6.36) v1(20.41,46.36) v1(20.41,8.36) v1(20.41,6.36) v1(22.41,40.36) v1(22.41,6.36) v1(22.71,25.99) v1(24.41,40.36) v1(24.41,38.36) v1(24.41,36.36) v1(24.41,34.36) v1(24.41,32.36) v1(24.41,30.36) v1(24.41,24.36) v1(24.41,22.36) v1(24.41,20.36) v1(24.41,18.36) v1(26.02,24.07) v1(26.41,42.36) v1(26.41,38.36) v1(26.41,36.36) v1(26.41,18.36) v1(26.41,16.36) v1(28.41,14.36) v1(28.41,4.36) v1(30.41,14.36) v1(30.41,4.36) v1(32.41,4.36) v1(34.41,4.36) v1(34.52,63.71) v1(34.54,62.98) v1(35.38,15.19) v1(36.06,66.04) v1(36.1,73.74) v1(36.13,71.7) v1(36.11,70.56) v1(36.08,65.18) v1(36.41,92.36) v1(36.41,90.36) v1(36.41,34.36) v1(36.41,4.36) v1(38.41,108.36) v1(38.41,106.36) v1(38.41,104.36) v1(38.41,102.36) v1(38.41,100.36) v1(38.41,98.36) v1(38.41,96.36) v1(38.42,46.87) v1(38.41,34.36) v1(38.41,32.36) v1(38.41,26.36) v1(38.41,24.36) v1(38.41,4.36) v1(39.06,78.03) v1(39.25,73.52) v1(39.26,72.73) v1(39.28,71.83) v1(40.37,79.01) v1(40.41,122.36) v1(40.41,120.36) v1(40.41,118.36) v1(40.41,116.36) v1(40.41,114.36) v1(40.41,112.36) v1(40.41,110.36) v1(40.41,34.36) v1(40.41,32.36) v1(40.41,30.36) v1(40.41,28.36) v1(40.41,26.36) v1(40.41,24.36) v1(40.41,4.36) v1(40.41,2.36) v1(41.5,50.17) v1(41.79,132.6) v1(41.89,76.66) v1(42.02,39.52) v1(42.41,128.36) v1(42.41,126.36) v1(42.41,124.36) v1(42.41,122.36) v1(42.41,120.36) v1(42.41,118.36) v1(42.41,116.36) v1(42.41,114.36) v1(42.41,112.36) v1(42.41,110.36) v1(42.41,104.36) v1(42.41,102.36) v1(42.41,100.36) v1(42.41,98.36) v1(42.41,96.36) v1(42.41,34.36) v1(42.41,32.36) v1(42.41,30.36) v1(42.41,28.36) v1(42.41,26.36) v1(42.41,24.36) v1(42.41,20.36) v1(42.41,18.36) v1(42.41,2.36) v1(42.55,137.17) v1(42.9,45.14) v1(44.08,46.8) v1(44.41,128.36) v1(44.41,126.36) v1(44.41,120.36) v1(44.41,118.36) v1(44.41,116.36) v1(44.41,114.36) v1(44.41,112.36) v1(44.41,34.36) v1(44.41,32.36) v1(44.41,30.36) v1(44.41,28.36) v1(44.41,26.36) v1(44.41,24.36) v1(44.41,20.36) v1(44.41,18.36) v1(44.41,2.36) v1(44.77,133.1) v1(46.41,136.36) v1(46.41,134.36) v1(46.41,132.36) v1(46.41,130.36) v1(46.41,128.36) v1(46.41,126.36) v1(46.41,124.36) v1(46.41,122.36) v1(46.41,106.36) v1(46.41,104.36) v1(46.41,102.36) v1(46.41,100.36) v1(46.41,98.36) v1(46.41,96.36) v1(46.46,51.99) v1(46.41,36.36) v1(46.41,26.36) v1(46.41,24.36) v1(46.41,20.36) v1(46.41,18.36) v1(46.41,14.36) v1(46.41,2.36) v1(46.57,66.11) v1(47.07,80.31) v1(48.03,47.67) v1(48.41,136.36) v1(48.41,134.36) v1(48.41,132.36) v1(48.41,130.36) v1(48.41,128.36) v1(48.41,126.36) v1(48.41,124.36) v1(48.41,122.36) v1(48.41,38.36) v1(48.41,26.36) v1(48.41,24.36) v1(48.41,20.36) v1(48.41,2.36) v1(49.18,54.56) v1(49.44,72.94) v1(49.65,75.73) v1(49.86,67.97) v1(50.41,136.36) v1(50.41,134.36) v1(50.41,132.36) v1(50.41,130.36) v1(50.41,128.36) v1(50.41,126.36) v1(50.41,124.36) v1(50.41,122.36) v1(50.41,38.36) v1(50.41,24.36) v1(50.41,20.36) v1(50.41,2.36) v1(52.41,136.36) v1(52.41,134.36) v1(52.41,132.36) v1(52.41,130.36) v1(52.41,128.36) v1(52.41,126.36) v1(52.41,124.36) v1(52.41,122.36) v1(52.46,66.25) v1(52.41,42.36) v1(52.41,38.36) v1(52.41,26.36) v1(52.41,24.36) v1(52.41,20.36) v1(52.41,2.36) v1(52.83,74.64) v1(52.97,43.85) v1(54.3,98.28) v1(54.35,66.94) v1(54.41,136.36) v1(54.41,134.36) v1(54.41,132.36) v1(54.41,130.36) v1(54.41,128.36) v1(54.41,126.36) v1(54.41,124.36) v1(54.41,122.36) v1(54.41,106.36) v1(54.39,74.43) v1(54.41,40.36) v1(54.41,38.36) v1(54.41,36.36) v1(54.41,26.36) v1(54.41,24.36) v1(54.41,20.36) v1(54.41,14.36) v1(54.41,2.36) v1(54.58,16.3) v1(55.85,64.13) v1(56.07,133.28) v1(56.08,53.72) v1(56.41,128.36) v1(56.41,126.36) v1(56.41,120.36) v1(56.41,40.36) v1(56.41,38.36) v1(56.41,36.36) v1(56.41,34.36) v1(56.41,32.36) v1(56.41,30.36) v1(56.41,28.36) v1(56.41,26.36) v1(56.41,24.36) v1(56.41,20.36) v1(56.41,18.36) v1(56.41,14.36) v1(56.41,2.36) v1(56.49,52.74) v1(56.62,56.29) v1(57.79,61.75) v1(58.2,72.87) v1(58.41,128.36) v1(58.41,126.36) v1(58.41,120.36) v1(58.41,112.36) v1(58.41,110.36) v1(58.41,108.36) v1(58.41,106.36) v1(58.41,104.36) v1(58.41,102.36) v1(58.41,100.36) v1(58.41,98.36) v1(58.41,18.36) v1(58.41,14.36) v1(58.41,2.36) v1(58.88,137.22) v1(59.07,80.31) v1(59.34,43.22) v1(59.39,46.13) v1(59.53,132.73) v1(59.81,53.71) v1(60.06,36.84) v1(60.25,128.49) v1(60.41,126.36) v1(60.41,124.36) v1(60.41,122.36) v1(60.41,120.36) v1(60.41,114.36) v1(60.41,112.36) v1(60.41,110.36) v1(60.41,108.36) v1(60.41,106.36) v1(60.41,104.36) v1(60.41,102.36) v1(60.41,100.36) v1(60.41,98.36) v1(60.41,14.36) v1(60.41,2.36) v1(60.88,49.04) v1(61.71,72.79) v1(62.41,112.36) v1(62.41,110.36) v1(62.41,108.36) v1(62.41,106.36) v1(62.41,104.36) v1(62.41,102.36) v1(62.41,100.36) v1(62.41,98.36) v1(62.68,32.45) v1(62.68,30.45) v1(62.68,28.45) v1(62.68,26.45) v1(62.68,24.45) v1(64.41,98.36) v1(64.41,96.36) v1(64.41,92.36) v1(64.62,56.29) v1(65.58,84.35) v1(66.14,58.89) v1(66.41,14.36) v1(66.68,36.45) v1(67.46,58.89) v1(67.59,74.94) v1(67.59,70.94) v1(72.41,4.36) v1(74.41,6.36) v1(76.41,8.36) v1(76.41,6.36) v1(78.41,10.36) v1(78.41,8.36) v1(78.41,6.36) v1(80.41,12.36) v1(80.41,10.36) v1(80.41,8.36) v1(80.41,6.36) v1(80.68,32.45) v1(80.68,26.45) v1(80.68,24.45) v1(80.68,22.45) v1(80.68,20.45) v1(81.14,36.11) v1(82.39,48.96) v1(82.41,14.36) v1(82.41,12.36) v1(82.41,10.36) v1(82.41,8.36) v1(82.41,6.36) v1(82.68,28.45) v1(82.68,26.45) v1(82.68,24.45) v1(84.41,16.36) v1(84.41,14.36) v1(84.41,12.36) v1(84.41,10.36) v1(84.41,8.36) v1(84.41,6.36) v1(84.55,34.44) v1(84.55,22.45) v1(84.68,28.45) v1(84.68,24.45) v1(86.41,16.36) v1(86.41,14.36) v1(86.41,12.36) v1(86.41,10.36) v1(86.41,8.36) v1(86.68,28.45) v1(88.41,16.36) v1(88.41,14.36) v1(88.41,12.36) v1(88.41,10.36) v1(88.41,8.36) v1(88.68,36.45) v1(88.68,28.45) v1(88.68,26.45) v1(88.68,24.45) v1(90.41,16.36) v1(90.41,14.36) v1(90.41,12.36) v1(90.41,10.36) v1(90.41,8.36) v1(90.68,28.45) v1(90.68,26.45) v1(90.68,24.45) v1(92.41,18.36) v1(92.41,16.36) v1(92.41,14.36) v1(92.41,12.36) v1(92.41,10.36) v1(92.41,8.36) v1(93.79,20.12) v1(94.41,18.36) v1(94.41,16.36) v1(94.41,14.36) v1(94.41,12.36) v1(94.41,10.36) v1(94.41,8.36) v1(95.09,22.65) v1(95.69,20.49) v1(96.17,18.34) v1(96.41,16.36) v1(96.41,14.36) v1(96.41,12.36) v1(96.41,10.36) v1(96.41,8.36) v1(97.66,9.01)
1A: length 144.3
  Top Layer w0.203: U13.2 82.85,44.92 v1(83.83,43.94) ; U14.7 36.52,28.78 37.28,29.53 37.28,31.44 v1(36.24,32.48)
  Bottom Layer w0.203: v1(83.83,43.94) 82.31,45.46 82.31,46.53 83.08,47.3 90.1,47.3 93.23,44.17 93.23,22.21 88.34,17.32 82.08,17.32 69.55,4.79 41.28,4.79 27.04,19.03 27.04,23.11 31.73,27.81 31.73,31.47 33.42,33.15 35.57,33.15 v1(36.24,32.48)
1B: length 132.9
  Top Layer w0.203: 35.25,28.57 33.93,29.9 33.93,31.62 v1(34.79,32.48) ; 81.42,46.19 81.48,46.25 v1(82.95,46.25)
  Bottom Layer w0.203: v1(34.79,32.48) 33.93,32.48 32.37,30.93 32.37,26.95 27.77,22.35 27.77,20.34 42.62,5.49 69.27,5.49 81.99,18.21 88.15,18.21 92.78,22.83 92.78,44.05 89.83,47 84.57,47 84.56,46.98 83.69,46.98 v1(82.95,46.25)
2A: length 127.6
  Top Layer w0.203: v1(83.17,40.29) 82.72,39.84 U13.6
  Bottom Layer w0.203: v1(83.17,40.29) 83.17,41.51 87.84,46.18 90.06,46.18 92.29,43.95 92.29,23.55 87.91,19.17 81.52,19.17 69.29,6.94 46.11,6.94 33.27,19.78 33.27,30.9 34.2,31.83 36.81,31.83 38.21,30.43 38.21,28.98 U14.5
2B: length 111.5
  Top Layer w0.203: 81.42,38.57 82.56,38.57 v1(83.62,39.62)
  Bottom Layer w0.203: v1(83.62,39.62) 87.86,43.86 87.86,45.14 88.4,45.69 89.6,45.69 91.66,43.62 91.66,23.95 87.69,19.98 81.35,19.98 69.21,7.84 46.71,7.84 33.84,20.71 33.84,25.89 35.25,27.3
3A: length 31.9
  Top Layer w0.203: v1(84.43,38.84) 84.7,38.57 86.89,38.57
  Bottom Layer w0.203: U15.7 63.65,27.54 63.65,30.49 64.74,31.59 72.59,31.59 79.84,38.84 v1(84.43,38.84)
3B: length 25.8
  Top Layer w0.203: v1(86.93,36.47) 86.93,37.26 U13.9
  Bottom Layer w0.203: U15.8 73.05,26.03 82.88,35.86 86.55,35.86 86.93,36.24 v1(86.93,36.47)
4A: length 35.3
  Top Layer w0.203: 86.89,43.65 87.31,43.65 v1(88.6,42.36)
  Bottom Layer w0.203: U15.5 65.16,27.51 64.17,28.49 64.17,30.45 64.91,31.19 72.88,31.19 79.72,38.03 84.57,38.03 88.6,42.06 v1(88.6,42.36)
4B: length 35.9
  Top Layer w0.203: U13.15 86.98,44.83 v1(88.78,44.83)
  Bottom Layer w0.203: U15.6 73.47,27.3 77.98,31.82 77.98,31.86 83.67,37.54 88.02,37.54 89.44,38.96 89.44,44.17 v1(88.78,44.83)
ADC_ANALOG_PWR: length 263.6
  Top Layer w0.3: U1.15 50.06,62.05 v1(50.22,62.2) ; 55.37,120.7 55.37,119.62 56.48,118.51 C476.1 ; U1.26 43.51,59.64 v1(43.1,60.05) ; v1(39.09,54.3) 39.44,54.64 39.44,59.4 37.82,61.01 v1(35.3,61.01)
  Top Layer w0.6: v1(58.35,114.09) 58.35,114.09 C#10.1 58.33,116.35 C476.1
  Inner1 w0.6: v1(71.12,40.98) 71.12,50.56 NOREF#2.1
  Inner2 w0.6: v1(58.35,114.09) 57.26,113.01 48.38,113.01 40.5,105.12 40.5,82.35 35.3,77.15 v1(35.3,61.01) ; NOREF#10.2 27.4,46.99 27.85,46.54 27.85,17.86 28.99,16.72 v2(33.99,16.72) ; v1(50.22,62.2) 49.16,61.15 42.1,61.15 39.09,58.14 v1(39.09,54.3) 37.63,52.83 37.63,44.99 34.04,41.4 34.04,16.77 v2(33.99,16.72) ; v1(71.12,40.98) 68.77,40.98 65.42,37.63 65.42,33.53 70.55,28.39 70.55,21.28 65.99,16.72 56.45,16.72 54.06,19.11 49.25,19.11 46.86,16.72 v2(33.99,16.72)
  Bottom Layer w0.3: v1(41.94,63.28) 40.95,63.28 40.91,63.32 ; v1(44.38,61.86) 44.38,63.64 ; v1(43.1,60.05) 43.08,60.02 42.57,60.02 41.22,61.37 40.93,61.37
ADC_DIG_PWR: length 33
  Top Layer w0.203: v1(47.87,55.23) 47.85,55.22 47.85,54.3 46,52.45 44.79,52.45 44.74,52.51 U1.40 42.19,52.51 v1(42.16,52.54) ; U1.12 51.56,60.34 52,59.9 v1(52,57.77)
  Inner2 w0.203: v1(47.87,55.23) 49.51,55.23 52,57.73 v1(52,57.77) 50.58,59.2 v1(47.84,59.2)
  Bottom Layer w0.203: v1(42.16,52.54) 41.5,52.54 C#30.1 ; 46.59,63.62 46.92,63.29 46.92,60.4 47.73,59.59 47.73,59.3 v1(47.84,59.2) 48.5,59.2 48.8,59.5 48.8,62.25 48.44,62.61 48.44,63.66 48.49,63.71
CLK: length 4.1
  Top Layer w0.3: U1.90 59.4,54.51 61.7,56.81 R331.2
D1: length 67.6
  Top Layer w0.203: U1.56 47.56,43.12 46.47,42.03 33.14,42.03 31.03,44.14 31.03,58.58 32.25,59.8 33.16,67.28 34.21,68.33 40.11,68.33 40.47,68.68 46.28,68.68 46.63,68.33 47.81,68.33 47.84,68.3 48.75,68.3 49.67,67.37 50.06,67.37 50.78,68.09 50.78,69.29 50.75,69.31 v1(50.75,70.89)
  Bottom Layer w0.203: v1(50.75,70.89) 50.75,71.95 R22.2
D2: length 70.1
  Top Layer w0.203: v1(49.18,42.2) 49.18,43.37 48.54,44.01 48.54,45.94 U1.58 ; v1(33.31,42.94) 33.31,43.44 31.39,45.36 31.39,58.5 32.47,59.58 arc(32.53,59.66) 32.56,59.76 33.44,67.07 34.34,67.96 40.18,67.96 40.59,68.38 46.08,68.38 46.47,67.98 48.63,67.98 49.56,67.06 50.53,67.06 52.04,68.56 U17.2 52.04,70.1 52.54,70.6 v1(52.54,70.95)
  Bottom Layer w0.203: v1(33.31,42.94) 34.31,41.94 48.92,41.94 v1(49.18,42.2) ; R23.2 52.54,71.87 v1(52.54,70.95)
D3: length 78.5
  Top Layer w0.203: U1.60 49.56,44.12 50.26,43.42 v1(50.26,41.97) ; 32.53,59.21 32,58.69 32,48.75 v1(33.04,47.71) ; 32.53,59.21 32.53,59.19 ; 32.53,59.21 32.69,59.37 arc(32.8,59.53) 32.86,59.72 33.72,66.85 34.4,67.53 40.18,67.53 40.72,68.07 45.89,68.07 46.28,67.68 46.34,67.68 46.34,67.68 48.5,67.68 49.43,66.75 51.03,66.75 53.31,69.03 U17.3 53.31,70.04 54.06,70.78 v1(54.06,71.07)
  Bottom Layer w0.203: v1(33.04,47.71) 33.04,43.6 32.29,42.84 32.29,39.52 34.44,37.37 45.66,37.37 v1(50.26,41.97) ; R24.2 54,71.13 v1(54.06,71.07)
D4: length 68.7
  Top Layer w0.203: U1.61 50.02,45.92 50.02,44.88 v1(51.4,43.51) ; v1(55.38,70.82) 54.59,70.02 U17.4 54.59,69.03 53.37,67.82 52.58,67.82 51.2,66.44 49.3,66.44 48.41,67.34 46.18,67.34 45.75,67.77 40.86,67.77 40.24,67.15 34.47,67.15 34.01,66.68 33.25,60.38 33.25,55.76 34.55,54.45 v1(34.55,48.8)
  Bottom Layer w0.203: v1(34.55,48.8) 34.55,47.16 38.62,43.09 40.62,43.09 41.46,42.25 48.28,42.25 48.61,42.57 48.61,42.58 49.54,43.51 v1(51.4,43.51) ; 55.69,72.12 55.69,71.13 v1(55.38,70.82)
D5: length 73.1
  Top Layer w0.203: v1(35.31,48.57) 35.81,49.07 35.81,55.2 33.57,57.44 33.57,60.5 34.26,66.23 34.78,66.75 40.28,66.75 40.99,67.46 45.59,67.46 46.07,66.98 48.34,66.98 49.18,66.14 51.33,66.14 52.71,67.52 55.66,67.52 v1(55.7,67.56) 55.85,67.71 U17.5 ; v1(50.39,47.98) 50.39,47.97 51.56,46.8 U1.64
  Bottom Layer w0.203: v1(55.7,67.56) 57.54,69.4 57.54,71.94 R26.2 ; v1(35.31,48.57) 39.44,44.44 40.48,44.44 40.87,44.05 40.87,43.75 41.72,42.9 47.35,42.9 48.46,44.01 49.41,44.01 50.39,44.99 v1(50.39,47.98)
D6: length 81.7
  Top Layer w0.203: v1(54.63,48.11) 54.56,48.04 U1.70 ; v1(46.96,43.45) 46.4,44.01 45.9,44.01 44.67,42.78 35.01,42.78 33.32,44.47 33.32,46.64 34.69,48.01 39.51,48.01 39.95,48.45 39.95,51.58 40.23,51.86 40.23,66.27 41.06,67.1 45.52,67.1 45.95,66.68 46.9,66.68 47.47,66.11 47.47,65.18 48.25,64.4 52.73,64.4 55,66.68 55.61,66.68 56.53,67.59 v1(56.58,67.59) 57.12,68.13 U17.6
  Inner1 w0.3: v1(46.96,43.45) 47.96,43.45 50.45,45.94 52.57,45.94 54.63,48 v1(54.63,48.11)
  Bottom Layer w0.203: R27.2 59.08,71.75 58.32,70.99 58.32,69.11 56.81,67.59 v1(56.58,67.59)
DD1: length 45.8
  Top Layer w0.203: 50.78,78.89 50.65,78.89 43.86,85.68 43.86,109.51 46.37,112.02 H6.20
DD2: length 46.8
  Top Layer w0.203: 46.87,120.7 46.87,111.6 44.39,109.12 44.39,85.7 48.79,81.31 50.18,81.31 52.04,79.44 U17.17
DD3: length 47.8
  Top Layer w0.203: U17.16 53.31,79.37 53.16,79.53 53.16,79.89 51.4,81.64 48.99,81.64 44.86,85.77 44.86,108.77 47.37,111.28 47.37,120.7
DD4: length 48.3
  Top Layer w0.203: H6.17 47.83,120.67 47.83,111.05 45.31,108.53 45.31,91.39 46.71,89.98 46.71,84.51 49.16,82.06 51.91,82.06 54.55,79.42 54.55,78.92 U17.15
DD5: length 48.6
  Top Layer w0.203: U17.14 55.85,79.6 53.01,82.44 49.48,82.44 47.1,84.81 47.1,90.27 46.47,90.91 46.47,92.8 48.38,94.71 48.38,109.66 48.37,109.67 H6.16
DD6: length 48.4
  Top Layer w0.203: U17.13 57.12,79.7 54.05,82.78 49.65,82.78 48.14,84.28 48.14,88.33 48.46,88.65 48.46,94.35 48.87,94.77 H6.15
EPWMA: length 37.9
  Top Layer w0.203: v1(50.07,50.55) 49.8,50.55 48.25,49.01 U1.47 ; U16.39 74.73,40.38 v1(75.06,40.71)
  Bottom Layer w0.203: v1(50.07,50.55) 57.93,50.55 60.56,47.92 68.58,47.92 75.06,41.44 v1(75.06,40.71)
EPWMB: length 36.3
  Top Layer w0.203: v1(48.29,49.83) 48.12,50.01 U1.45 ; U16.40 74.23,39.69 74.23,40.97 v1(74.49,41.22)
  Bottom Layer w0.203: v1(48.29,49.83) 58.22,49.83 60.52,47.53 68.32,47.53 74.49,41.37 v1(74.49,41.22)
EQEP1A: length 34.2
  Top Layer w0.203: 81.42,43.65 75.72,43.65 74.65,44.72 69.61,44.72 66.89,42 v1(55.12,42) ; v1(52.82,43.03) 51.06,44.79 U1.63
  Bottom Layer w0.203: v1(52.82,43.03) 54.09,43.03 v1(55.12,42)
EQEP1B: length 33.1
  Top Layer w0.203: v1(68.01,41.9) 70.44,44.33 74.43,44.33 77.66,41.11 77.96,41.11 77.98,41.13 79.09,41.13 79.11,41.11 U13.5 ; U1.67 53.04,45.94 53.04,45.26 53.4,44.9 54.3,44.9 v1(54.91,44.29)
  Bottom Layer w0.203: v1(68.01,41.9) 56.88,41.9 54.91,43.86 v1(54.91,44.29)
EQEP2A: length 33.1
  Top Layer w0.203: v1(69.84,49.21) 70.63,49.21 74.28,45.56 83.37,45.56 84.46,44.46 84.46,43.57 85.66,42.38 U13.13 ; v1(65.34,51.91) 60.24,51.91 59.33,51.01 U1.83
  Bottom Layer w0.203: v1(65.34,51.91) 67.13,51.91 v1(69.84,49.21)
EQEP2B: length 39.2
  Top Layer w0.203: v1(70.25,48.49) 70.25,48.36 70.28,48.34 70.28,47.69 72.85,45.11 74.89,45.11 75.72,44.28 82.45,44.28 82.99,43.74 82.99,42.4 85.49,39.9 86.83,39.9 U13.11 ; U1.91 57.52,55.01 57.21,54.7 57.21,54.06 v1(57.12,53.96)
  Bottom Layer w0.203: v1(70.25,48.49) 70.09,48.65 69.61,48.65 67.35,50.91 65.1,50.91 63.92,52.09 58.99,52.09 v1(57.12,53.96)
FAN: length 58.6
  Top Layer w0.203: v1(55.37,47.73) 55.37,48.16 54.26,49.26 54.26,58.89 53.53,59.62 53.53,61.02 U1.8 ; R103#2.1 21.33,37.66 R102.2 32.3,37.68 33.21,36.77 44.03,36.77 47.49,40.23 52.3,40.23 55.41,43.34 v1(56.27,43.34)
  Bottom Layer w0.203: v1(55.37,47.73) 56.27,46.82 v1(56.27,43.34)
FLASH_PWR: length 8.3
  Top Layer w0.203: 59.09,57.51 U1.96
  Top Layer w0.3: L#3.2 60.31,62.53 C#9.1 61.74,58.96 C#8.1 61.51,58.95 60.72,58.16 60.06,58.16 59.4,57.51 59.09,57.51
LED1: length 52
  Top Layer w0.203: v1(64.55,53.92) 66.14,52.33 66.14,51.92 65.11,50.89 61.3,50.89 59.41,49.01 U1.79 ; SW1.1 66.46,75.32 66.46,85.17 62.1,89.53 LED1.2
  Inner2 w0.4: v1(64.55,53.92) 64.43,53.92 63.53,54.82 63.53,68.83 64.32,69.62 64.32,73.24 65.39,74.31 SW1.1
LQ1: length 32.3
  Top Layer w0.203: U1.23 46.06,60.01 46.45,59.62 v1(46.45,59.61)
  Bottom Layer w0.203: v1(46.45,59.61) 43.82,56.98 43.82,56.2 45.79,54.23 45.79,52.03 42.22,48.46 38.09,48.46 37.06,49.5 33.67,49.5 30.81,46.64 R53.1 30.72,45.33 C58.2
LQ2: length 26.6
  Top Layer w0.203: U1.22 46.56,60.34 47.07,59.83 v1(47.07,59.16)
  Bottom Layer w0.203: v1(47.07,59.16) 47.01,59.22 47.01,59.85 46.19,60.67 42.95,60.67 41.19,62.42 34.72,62.42 28.91,56.61 R55.1 28.6,54.8 C59.2
LQQ1: length 6.7
  Bottom Layer w0.203: NOREF#13.1 24.94,46.34 25.83,45.44 26.8,45.44 26.99,45.63 ; C58.1 27.56,45.34 R52.2
LQQ2: length 5.6
  Bottom Layer w0.203: R54.2 31.72,54.78 C59.1 27.82,52.58 NOREF#16.2
MOTOR_AIN1: length 39.3
  Top Layer w0.203: v1(74.19,43.67) 74.19,41.71 73.93,41.45 73.93,40.38 73.71,40.17 73.71,39.7 U16.41 ; v1(51.59,51.91) 50.63,51.91 49.24,50.51 U1.44
  Bottom Layer w0.203: v1(74.19,43.67) 73.9,43.67 68.99,48.58 66.16,48.58 64.49,50.26 64.49,50.98 63.72,51.75 51.75,51.75 v1(51.59,51.91)
MOTOR_AIN2: length 35.6
  Top Layer w0.203: v1(45.42,47.57) 45.42,47.26 45.06,46.9 45.06,45.96 U1.51 ; v1(72.56,41.42) 72.62,41.36 73.29,41.36 73.62,41.03 73.62,40.56 73.23,40.16 U16.42
  Bottom Layer w0.203: v1(45.42,47.57) 45.56,47.57 47.27,49.28 58.25,49.28 60.39,47.14 66.84,47.14 v1(72.56,41.42)
MOTOR_BIN1: length 43.4
  Top Layer w0.203: U1.48 48.82,48.51 51.36,51.05 v1(51.36,51.14) ; v1(73.06,40.8) 72.73,40.47 U16.43
  Bottom Layer w0.203: v1(73.06,40.8) 73.89,39.97 75.81,39.97 76.14,40.3 76.14,40.91 68.77,48.28 60.85,48.28 57.98,51.14 v1(51.36,51.14)
MOTOR_BIN2: length 32.8
  Top Layer w0.203: U16.44 72.23,40.68 v1(72.18,40.72) ; U1.53 46.06,47.28 v1(46.23,47.45)
  Bottom Layer w0.203: v1(72.18,40.72) 72.18,40.77 66.93,46.02 60.31,46.02 57.38,48.95 47.4,48.95 46.23,47.78 v1(46.23,47.45)
Q1: length 42.8
  Top Layer w0.203: v1(45.6,62.49) 45.88,62.2 46.84,62.2 47.06,61.98 U1.21
  Bottom Layer w0.203: v1(45.6,62.49) 45.53,62.55 45.53,67.73 43.81,69.45 40.04,69.45 37.16,72.33 37.16,89.63 39.26,91.72 40.21,91.72 41.13,92.65 R31.1 43.26,92.65 C47.2
Q2: length 40.9
  Top Layer w0.203: v1(46.36,62.76) 46.71,62.76 47.56,61.91 U1.20
  Bottom Layer w0.203: v1(46.36,62.76) 46.11,62.76 45.84,63.04 45.84,68.08 44.05,69.87 40.17,69.87 37.5,72.54 37.5,88.37 38.77,89.64 40.35,89.64 41.29,90.58 R33.1 43.33,90.58 C48.2
Q3: length 39.3
  Top Layer w0.203: U1.19 48.06,60.05 v1(48.2,59.91)
  Bottom Layer w0.203: C49.2 43.27,88.58 R35.1 40,87.27 38.81,87.27 37.86,86.32 37.86,74.85 38.57,74.14 40.3,74.14 47.29,67.14 47.29,60.82 v1(48.2,59.91)
Q4: length 34.6
  Top Layer w0.203: v1(47.92,62.34) 48.08,62.34 48.56,61.86 U1.18
  Bottom Layer w0.203: v1(47.92,62.34) 47.67,62.59 47.67,67.34 40.48,74.53 38.71,74.53 38.16,75.08 38.16,84.08 39.42,85.33 40.12,85.33 41.23,86.44 R37.1 43.18,86.44 C50.2
Q5: length 33.4
  Top Layer w0.203: v1(49.79,62.86) 49.62,62.68 49.62,62.42 49.06,61.87 U1.17
  Bottom Layer w0.203: v1(49.79,62.86) 49.79,63.1 49.21,63.68 49.21,66.31 40.6,74.92 38.89,74.92 38.49,75.32 38.49,82.82 39.13,83.47 40.59,83.47 41.3,84.18 R39.1 41.3,84.41 C51.2
Q6: length 37.8
  Top Layer w0.203: v1(46.07,58.03) 43.54,58.03 U1.29
  Bottom Layer w0.203: 41.42,82.41 43.3,82.41 C52.2 ; 41.42,82.41 R41.1 ; 41.42,82.41 41.46,82.37 41.46,81.87 43.75,79.59 43.75,78.19 43.54,77.97 43.54,76.86 43.68,76.72 43.68,72.55 47.65,68.59 47.65,68.46 47.79,68.31 47.92,68.31 47.94,68.3 48.54,68.3 49.73,67.1 49.73,64.9 49.74,64.89 49.74,64.6 49.94,64.39 51.04,64.39 51.27,64.16 51.27,61.2 48.09,58.02 46.19,58.02 46.18,58.03 v1(46.07,58.03)
Q7: length 45.8
  Top Layer w0.203: v1(45.49,57.46) 45.45,57.51 U1.30
  Bottom Layer w0.203: v1(45.49,57.46) 45.51,57.48 47.98,57.48 51.58,61.08 51.58,74.46 52.45,75.33 59.44,75.33 63.42,79.31 63.42,83.45 63.29,83.58 62.2,83.58 61.21,84.56 61.09,84.56 R43.1 60.99,84.51 C53.2
Q8: length 47.7
  Top Layer w0.203: v1(47.17,56.91) 46.82,56.91 46.82,56.9 44.56,56.9 44.46,57.01 U1.31
  Bottom Layer w0.203: v1(47.17,56.91) 47.23,56.96 48.04,56.96 53.31,62.23 53.31,74.15 54.18,75.02 59.56,75.02 63.73,79.18 63.73,84.98 63.08,85.62 62.22,85.62 62.07,85.77 61.98,85.77 61.83,85.92 61.83,86.01 61.31,86.53 61.06,86.53 R45.1 59.05,86.46 C54.2
Q9: length 49.2
  Top Layer w0.203: v1(46.59,56.34) 46.42,56.51 U1.32
  Bottom Layer w0.203: C55.2 60.9,88.38 R47.1 61.22,88.41 62.18,87.45 62.7,87.45 64.03,86.11 64.03,79.06 59.62,74.64 56.76,74.64 56.37,74.26 56.37,73.14 56.09,72.86 55.16,72.86 54.73,72.43 54.73,69.86 53.73,68.86 53.73,62.07 48,56.33 46.6,56.33 v1(46.59,56.34)
Q10: length 53.4
  Top Layer w0.203: v1(45.93,55.66) 45.57,56.01 43.52,56.01 U1.33
  Bottom Layer w0.203: v1(45.93,55.66) 46.06,55.79 46.35,55.79 46.35,55.79 46.82,55.79 46.82,55.79 47.97,55.79 54.12,61.95 54.12,65.93 54.97,66.77 54.97,68.91 56.68,70.61 56.68,74.13 56.83,74.28 59.69,74.28 64.34,78.93 64.34,83.45 64.86,83.98 64.86,88.76 63.96,89.67 62.56,89.67 62.48,89.74 61.93,89.74 61.78,89.89 61.78,90.44 61.61,90.61 61.12,90.61 R49.1 59.01,90.42 C56.2
Q11: length 55.3
  Top Layer w0.203: U1.16 49.56,56.63 v1(49.6,56.59)
  Bottom Layer w0.203: C57.2 60.8,92.54 R51.1 61.81,91.53 62.52,91.53 66.14,87.91 66.15,81.61 65.79,81.25 65.79,79.89 59.94,74.04 59.94,70.03 58.03,68.13 58.03,64.13 59.11,63.04 59.11,61.97 57.98,60.84 53.53,60.84 50.01,57.31 50.01,57 v1(49.6,56.59)
QQ1: length 32.7
  Top Layer w0.203: 49.37,120.7 49.39,120.69 49.39,94.49 v1(49.02,94.12)
  Bottom Layer w0.203: C47.1 48.82,92.64 R30.2 49.02,92.64 v1(49.02,94.12)
